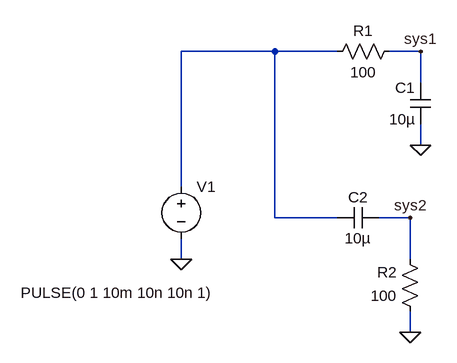
[diagram p0: schematic systemeDiff.asc]
systemeDiff.asc, the LTspice schematic file:
Version 4
SHEET 1 880 680
WIRE -80 96 -224 96
WIRE 16 96 -80 96
WIRE 144 96 96 96
WIRE 144 144 144 96
WIRE 144 240 144 208
WIRE -224 304 -224 96
WIRE -80 352 -80 96
WIRE 16 352 -80 352
WIRE 128 352 80 352
WIRE -224 416 -224 384
WIRE 128 416 128 352
WIRE 128 528 128 496
FLAG -224 416 0
FLAG 128 528 0
FLAG 144 240 0
FLAG 144 96 sys1
FLAG 128 352 sys2
SYMBOL cap 160 208 R180
WINDOW 0 24 56 Left 2
WINDOW 3 24 8 Left 2
SYMATTR InstName C1
SYMATTR Value 10µ
SYMBOL res 112 80 R90
WINDOW 0 0 56 VBottom 2
WINDOW 3 32 56 VTop 2
SYMATTR InstName R1
SYMATTR Value 100
SYMBOL res 144 512 R180
WINDOW 0 36 76 Left 2
WINDOW 3 36 40 Left 2
SYMATTR InstName R2
SYMATTR Value 100
SYMBOL cap 80 336 R90
WINDOW 0 0 32 VBottom 2
WINDOW 3 32 32 VTop 2
SYMATTR InstName C2
SYMATTR Value 10µ
SYMBOL voltage -224 288 R0
WINDOW 3 -247 179 Left 2
WINDOW 123 0 0 Left 2
WINDOW 39 0 0 Left 2
SYMATTR InstName V1
SYMATTR Value PULSE(0 1 10m 10n 10n 1)

The netlist it stands for:
* systemeDiff.asc
C1 0 sys1 10µ
R1 sys1 N001 100
R2 0 sys2 100
C2 sys2 N001 10µ
V1 N001 0 PULSE(0 1 10m 10n 10n 1)
.backanno
.end